# EAGLE design RFUSBtoDB15Adapter (EAGLE 9.6.2)
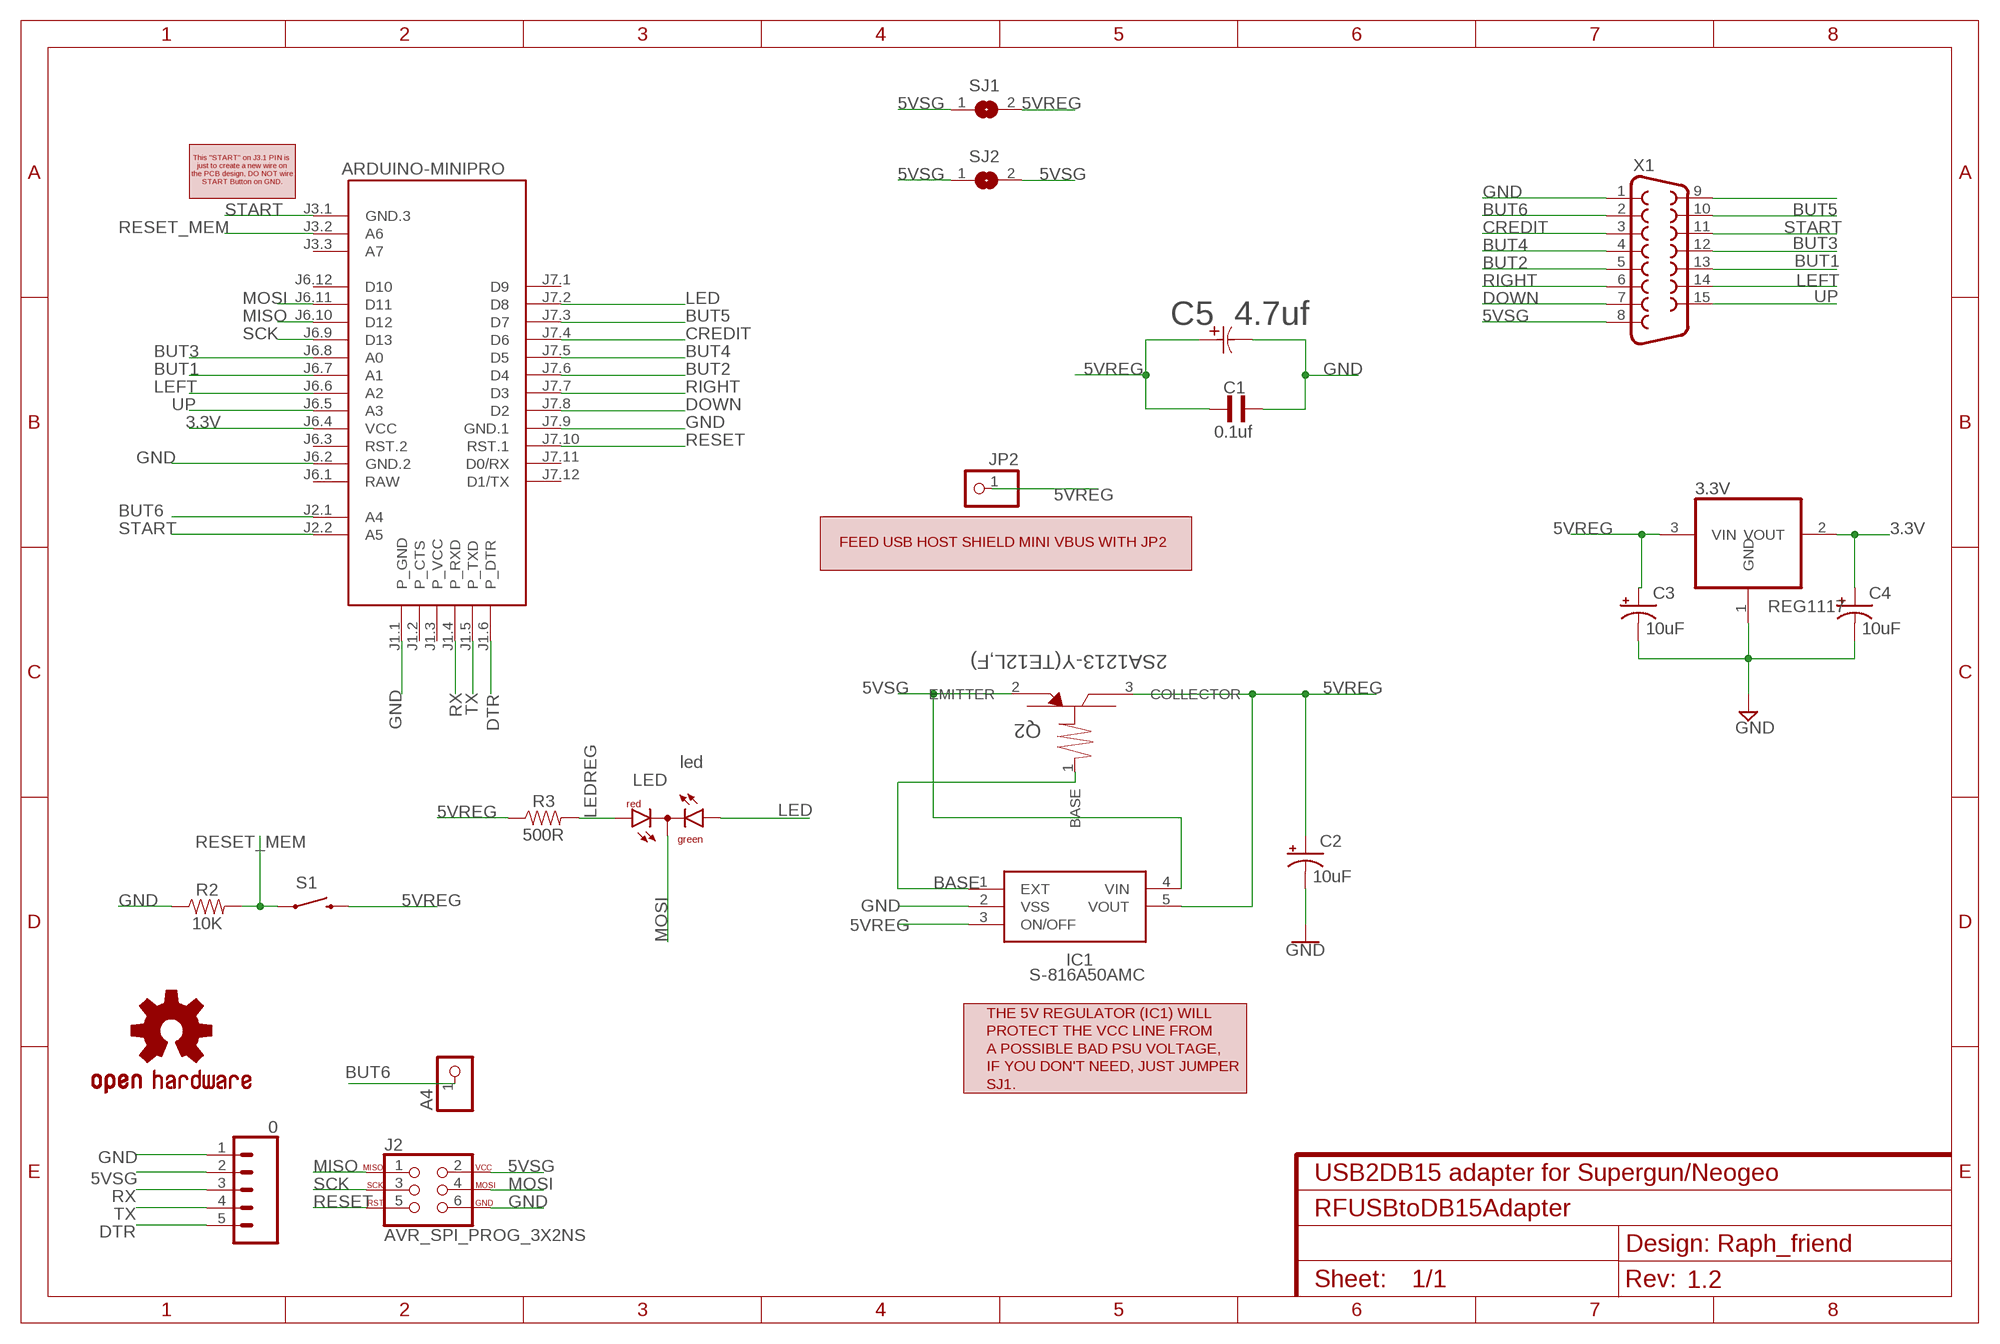
[diagram p0: schematic, sheet 1]
FRAME1 (FRAME-A4L): CNAME: USB2DB15 adapter for Supergun/Neogeo; CREVISION: 1.2; DESIGNER: Design: Raph_friend

## Parts
3.3V  REG1117  [SOT223]
A4  0  PINHD-1X1  [1X01]
ARDUINO-MINIPRO  ARDUINO-PRO-MINI-5.0V  [ARDUINO-PRO-MINI]
C1  0.1uf  WCAP-CSGP_0805_885012006082_REFLOW  [WCAP-CSGP_0805_REFLOW]
C2  10uF  10UF-POLAR-EIA3216-16V-10%(TANT)  [EIA3216]
C3  10uF  10UF-POLAR-EIA3216-16V-10%(TANT)  [EIA3216]
C4  10uF  10UF-POLAR-EIA3216-16V-10%(TANT)  [EIA3216]
C5  4.7uf  T491A475K010AT  [CAPMP3.4X1.6_1.8N_KEM]
IC1  S-816A40AMC-BAPT2U  [SOT95P275X130-5N]
J1  0  CONN_05  [1X05]
J2  AVR_SPI_PROG_3X2NS  [2X3-NS]
JP2  JP2  PINHD-1X1  [1X01]
LED  led  DUOLED-RG-C  [DUOLED-C-5MM]
LOGO1  OSHW-LOGOS  [OSHW-LOGO-S]
Q2  2SA1213-Y(TE12L,F)  [PW-MINI_TOS]
R2  10K  0.3OHM-0805-1/8W-1%  [0805]
R3  500R  0.3OHM-0805-1/8W-1%  [0805]
S1  RS032G05A3SM-SPST-MOMENTARY-SWSMD-1101NE  [TACTILE-SWITCH-1101NE]
SJ1  SJ  [SJ]
SJ2  SJ  [SJ]
X1  F15HP  [F15HP]

## Nets
3.3V: 3.3V.2(VOUT) ARDUINO-MINIPRO.J6.4(VCC) C4.+
5VREG: 3.3V.3(VIN) C1.2 C2.+ C3.+ C5.1 IC1.3(ON/OFF) IC1.5(VOUT) JP2.1 Q2.3(COLLECTOR) R3.1 S1.2 SJ1.2
5VSG: IC1.4(VIN) J1.2 J2.2 Q2.2(EMITTER) SJ1.1 SJ2.1 SJ2.2 X1.8
BASE: IC1.1(EXT) Q2.1(BASE)
BUT1: ARDUINO-MINIPRO.J6.7(A1) X1.13
BUT2: ARDUINO-MINIPRO.J7.6(D4) X1.5
BUT3: ARDUINO-MINIPRO.J6.8(A0) X1.12
BUT4: ARDUINO-MINIPRO.J7.5(D5) X1.4
BUT5: ARDUINO-MINIPRO.J7.3(D7) X1.10
BUT6: A4.1 ARDUINO-MINIPRO.J2.1(A4) X1.2
CREDIT: ARDUINO-MINIPRO.J7.4(D6) X1.3
DOWN: ARDUINO-MINIPRO.J7.8(D2) X1.7
DTR: ARDUINO-MINIPRO.J1.6(P_DTR) J1.5
GND: 3.3V.1(GND) ARDUINO-MINIPRO.J1.1(P_GND) ARDUINO-MINIPRO.J6.2(GND.2) ARDUINO-MINIPRO.J7.9(GND.1) C1.1 C2.- C3.- C4.- C5.2 IC1.2(VSS) J1.1 J2.6 R2.1 X1.1
LED: ARDUINO-MINIPRO.J7.2(D8) LED.AX(AG)
LEDREG: LED.AR R3.2
LEFT: ARDUINO-MINIPRO.J6.6(A2) X1.14
MISO: ARDUINO-MINIPRO.J6.10(D12) J2.1
MOSI: ARDUINO-MINIPRO.J6.11(D11) J2.4 LED.C
N$8: X1.9
RESET: ARDUINO-MINIPRO.J7.10(RST.1) J2.5
RESET_MEM: ARDUINO-MINIPRO.J3.2(A6) R2.2 S1.1
RIGHT: ARDUINO-MINIPRO.J7.7(D3) X1.6
RX: ARDUINO-MINIPRO.J1.4(P_RXD) J1.3
SCK: ARDUINO-MINIPRO.J6.9(D13) J2.3
START: ARDUINO-MINIPRO.J2.2(A5) ARDUINO-MINIPRO.J3.1(GND.3) X1.11
TX: ARDUINO-MINIPRO.J1.5(P_TXD) J1.4
UP: ARDUINO-MINIPRO.J6.5(A3) X1.15
Unconnected: ARDUINO-MINIPRO.J1.2(P_CTS) ARDUINO-MINIPRO.J1.3(P_VCC) ARDUINO-MINIPRO.J3.3(A7) ARDUINO-MINIPRO.J6.3(RST.2) ARDUINO-MINIPRO.J6.12(D10) ARDUINO-MINIPRO.J7.1(D9) ARDUINO-MINIPRO.J7.11(D0/RX) ARDUINO-MINIPRO.J7.12(D1/TX)

## Notes on the sheet
- This "START" on J3.1 PIN is 
  just to create a new wire on
   the PCB design, DO NOT wire 
  START Button on GND.
- FEED USB HOST SHIELD MINI VBUS WITH JP2
- THE 5V REGULATOR (IC1) WILL 
  PROTECT THE VCC LINE FROM 
  A POSSIBLE BAD PSU VOLTAGE, 
  IF YOU DON'T NEED, JUST JUMPER 
  SJ1.

## Power pins joined to a net without a drawn wire
RAW: ARDUINO-MINIPRO.J6.1(RAW)

## Library data of the parts
3.3V = burr-brown:REG1117: 800mA and 1A Low Dropout (LDO) Positive Regulator 1.8V, 2.5V, 2.85V, 3.3V, 5V, and Adj; MPN: REG1117; OC_FARNELL: 1097566; OC_NEWARK: 14P6981
A4 JP2 = pinhead:PINHD-1X1: PIN HEADER
ARDUINO-MINIPRO = Arduino:ARDUINO-PRO-MINI-*: Arduino Pro Mini and compatible devices More details available here: https://www.arduino.cc/en/Main/ArduinoBoardProMini Click here to find device on ebay.com <http://www.ebay.com/sch/arduino+pro+mini>
C1 = Wurth_Elektronik_Passive_Capacitors_rev18b:WCAP-CSGP_0805: WCAP-CSGP Ceramic Capacitors Characteristics Multilayer Ceramic Chip Capacitor Recommended soldering:Reflow, for 0603 and 0805 wave soldering is also allowed Operating temperature:-55 °C to +125 °C; Ceramic characteristics: Class I - NPO ; Class II -X7R, X5R High performance ceramic High capacitance stability Minimal aging Termination:Cu/Ni/Sn <http://katalog.we-online.de/media/images/eisos/WCAP-CSGP_pf2.jpg> Details see: http://katalog.we-online.de/en/pbs/WCAP-CSGP-0805? Created: 2015-01-28 2015 (C) Wurth Elektronik
C2-C4 = SparkFun-Capacitors:10UF-POLAR: 10.0µF polarized capacitors A capacitor is a passive two-terminal electrical component used to store electrical energy temporarily in an electric field.; PROD_ID: CAP-00811
C5 = tantalum cap:T491A475K010AT; BUILT_BY: EMA_Frank; MANUFACTURER_PART_NUMBER: T491A475K010AT; SOURCELIBRARY: Kemet_2020-03-25_3; SOURCE_LIBRARY: Kemet_2020-03-25_3.xlr; VENDOR: Kemet
IC1 = S-816A40AMC-BAPT2U:S-816A40AMC-BAPT2U: Linear Regulator Positive 4V 1A 5-Pin SOT-23 T/R - Tape and Reel Source: Datasheet; DESCRIPTION: Linear Regulator Positive 4V 1A 5-Pin SOT-23 T/R - Tape and Reel; HEIGHT: 1.3mm; MANUFACTURER_NAME: ABLIC U.S.A. Inc.; MANUFACTURER_PART_NUMBER: S-816A50AMC; MOUSER_PART_NUMBER: 628-816A40AMC-G; MOUSER_PRICE-STOCK: https://www.mouser.co.uk/ProductDetail/ABLIC/S-816A40AMC-BAPT2U?qs=sE1HjTVAc2jVIq95GYmZfQ%3D%3D
J1 = SparkFun-Connectors:CONN_05: Multi connection point. Often used as Generic Header-pin footprint for 0.1 inch spaced/style header connections On any of the 0.1 inch spaced packages, you can populate with these: Break Away Headers - Straight <https://www.sparkfun.com/products/116> (PRT-00116) Break Away Male Headers - Right Angle <https://www.sparkfun.com/products/553> (PRT-00553) Female Headers <https://www.sparkfun.com/products/115> (PRT-00115) Break Away Headers - Machine Pin <https://www.sparkfun.com/products/117> (PRT-00117) Break Away Female Headers - Swiss Machine Pin <https://www.sparkfun.com/products/743> (PRT-00743) For SCREWTERMINALS and SPRING TERMINALS visit here: Screw Terimnals on SparkFun.com <https://www.sparkfun.com/search/results?term=Screw+Terminals> (5mm/3.5mm/2.54mm spacing) This device is also useful as a general connection point to wire up your design to another part of your project. Our various solder wires solder well into these plated through hole pads. Hook-Up Wire - Assortment (Stranded, 22 AWG) <https://www.sparkfun.com/products/11375> (PRT-11375) Hook-Up Wire - Assortment (Solid Core, 22 AWG) <https://www.sparkfun.com/products/11367> (PRT-11367) View the entire wire category on our website here <https://www.sparkfun.com/categories/141> Special notes: Molex polarized connector foot print use with SKU : PRT-08231 with associated crimp pins and housings. 1MM SMD Version SKU: PRT-10208
J2 = SparkFun-Connectors:AVR_SPI_PROG_3X2: AVR ISP 6 Pin This is the reduced ISP connector for AVR programming. Common on Arduino. This footprint will take up less PCB space and can be used with a 10-pin to 6-pin adapter such as SKU: BOB-08508 **Special note about "TEST_POINT" package. The stop mask is on the top side, so if you want your programming test points to be on the bottom of your board, make sure to place this package on the bottom side of the board. This also ensure that the orientation to program from the bottom side will be correct. SparkFun Products: SparkFun ISP Pogo Adapter <https://www.sparkfun.com/products/11591> - NS Tiny AVR Programmer <https://www.sparkfun.com/products/11801> -PTH
LED = led:DUOLED-RG-C: DUO LED 2 colors (red/green), 5 mm, round, common Cathode www.ligitek.com or other producers.
LOGO1 = SparkFun-Aesthetics:OSHW-LOGO: Open-Source Hardware (OSHW) Logo This logo indicates the piece of hardware it is found on incorporates a OSHW license and/or adheres to the definition of open source hardware found here: http://freedomdefined.org/OSHW
Q2 = 2SA1213YTE12LF:2SA1213-Y(TE12L,F); BUILT_BY: EMA_UL_Team; COPYRIGHT: Copyright (C) 2018 Accelerated Designs. All rights reserved; MANUFACTURER_PART_NUMBER: 2SA1213-Y; SOURCELIBRARY: Toshiba_2019-12-10; VENDOR: Toshiba
R2 R3 = SparkFun-Resistors:0.3OHM: 0.3Ω resistor A resistor is a passive two-terminal electrical component that implements electrical resistance as a circuit element. Resistors act to reduce current flow, and, at the same time, act to lower voltage levels within circuits. - Wikipedia; PROD_ID: RES-11622; VALUE: 0.3
S1 = BeagleBone_Blue_R3:RS032G05A3SM-SPST-MOMENTARY-SW: 6x3.5mm 2-pin Momentary Switch (Push-button) Digikey Link <https://www.digikey.com/products/en?keywords=CKN10388TR-ND> Datasheet <https://media.digikey.com/pdf/Data%20Sheets/C&K/RS-032G05_-SM_RT.pdf>; PROD_ID: SWCH-00815
SJ1 SJ2 = jumper:SJ: SMD solder JUMPER
X1 = con-subd:F15: SUB-D; OC_FARNELL: unknown; OC_NEWARK: unknown

## Board
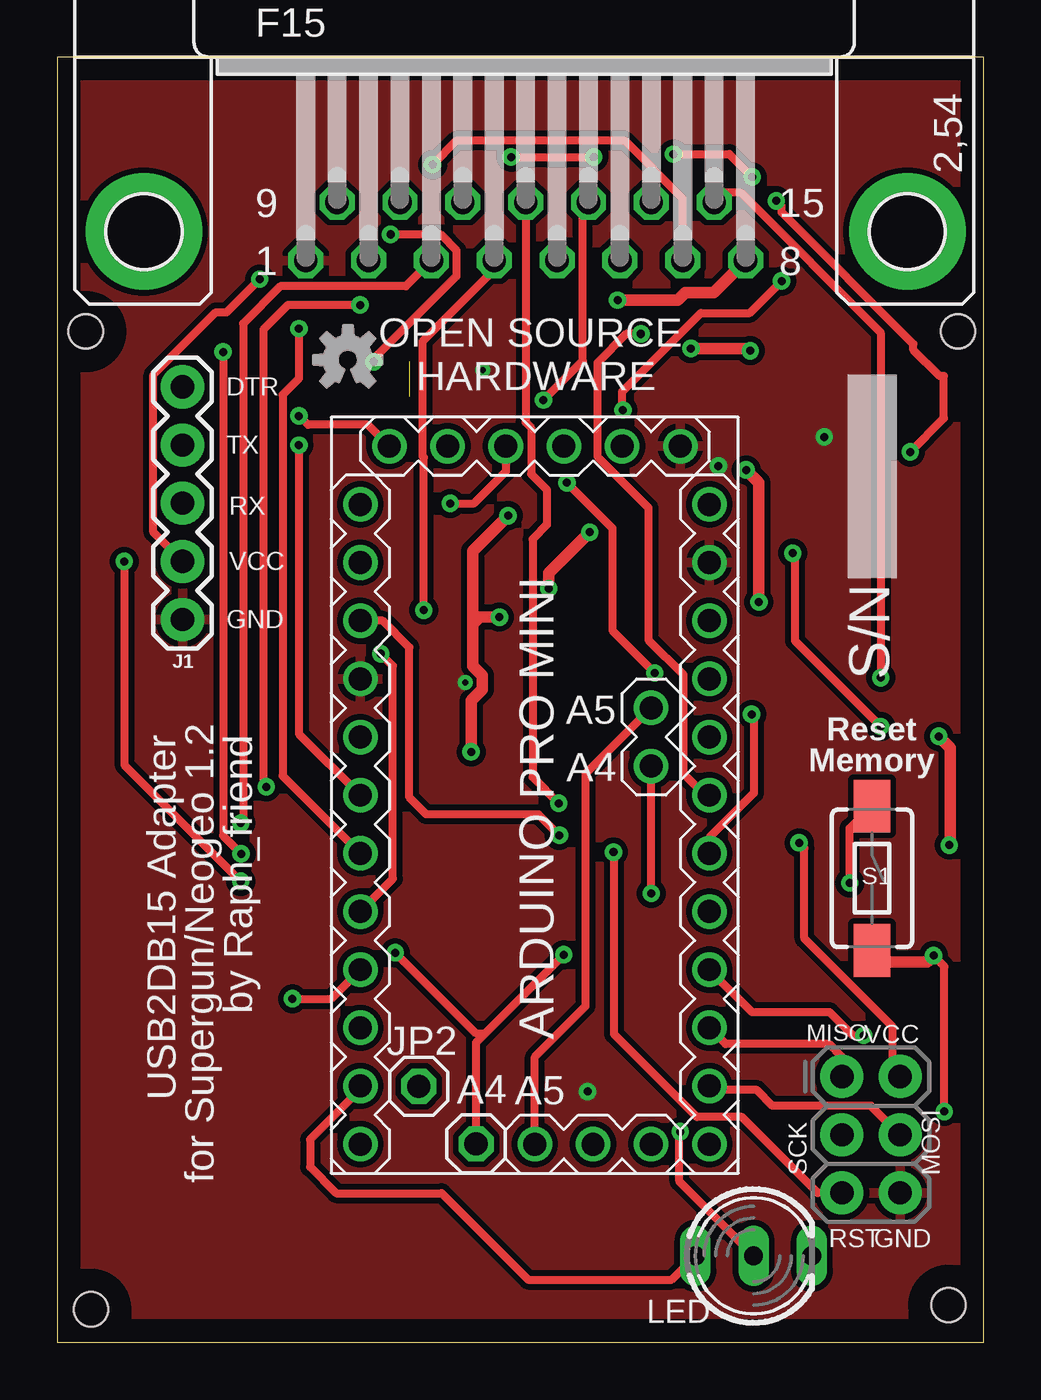
[diagram p1: board, top side]
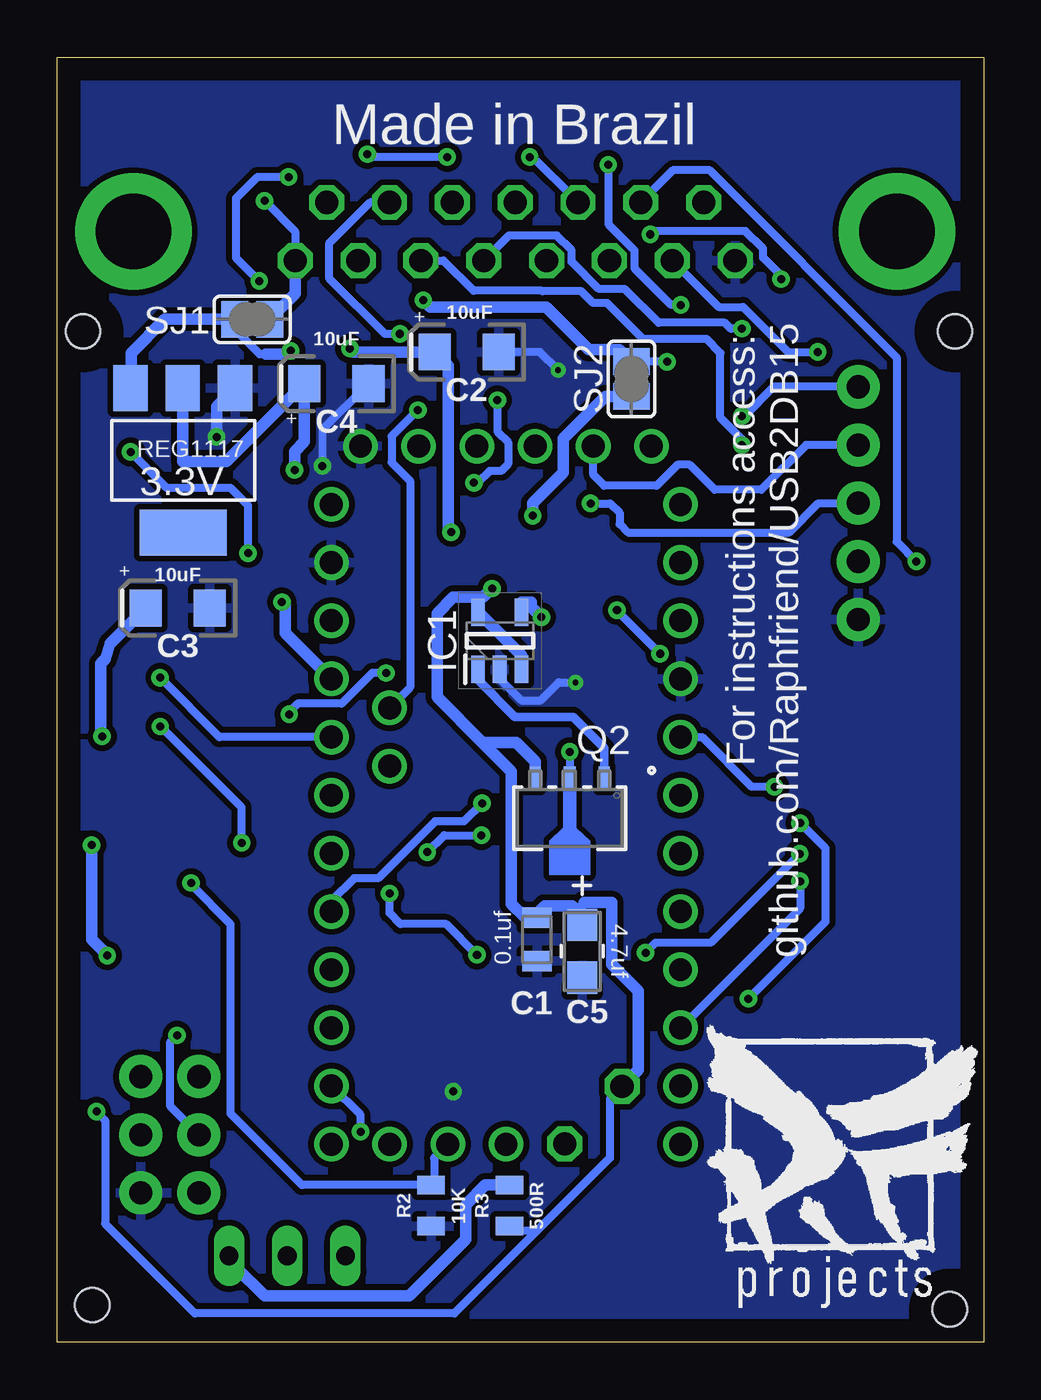
[diagram p2: board, bottom side, seen from below]

Size 40.44 x 56.12 mm. Coordinates in mm from the lower left corner, seen from the top.
Outline: 0,0 40.44,0 40.44,56.12 0,56.12 0,0
Copper layers (1*16): Top 0.035mm / dielectric 1.5mm / Bottom 0.035mm
Design rules "default *": minimum track width 14mil, minimum drill 0.25mm, track to track 10mil, track to pad 6mil, pad to pad 6mil, via to via 6mil, smd to smd 6mil, copper to edge 40mil, drill to drill 6mil, minimum pad ring 10mil, minimum via ring 8mil, stop-mask expansion 4mil, vias tented up to drill 50mil, thermal gap 10mil
Holes 1.5 mm at 1.24,44.14 39.32,44.14 38.91,1.62 1.47,1.44

### Footprints (pad centres in the part's own frame; a part is rotated, then mirrored left to right if it is on the bottom)
SOT223 = smd 1.499 x 2.007: 1 -2.261,-3.15; 2 0.025,-3.15; 3 2.311,-3.15 | smd 3.81 x 2.007: 4 0,3.15
1X01 = drill 1.016 octagon: 1 0,0
ARDUINO-PRO-MINI = drill 1: J1.1 -15.24,6.35; J1.2 -15.24,3.81; J1.3 -15.24,1.27; J1.4 -15.24,-1.27; J1.5 -15.24,-3.81; J1.6 -15.24,-6.35; J2.1 -1.27,5.08; J2.2 -3.81,5.08; J3.1 15.24,0; J3.2 15.24,2.54; J3.3 15.24,5.08; J6.1 -12.7,7.62; J6.2 -10.16,7.62; J6.3 -7.62,7.62; J6.4 -5.08,7.62; J6.5 -2.54,7.62; J6.6 0,7.62; J6.7 2.54,7.62; J6.8 5.08,7.62; J6.9 7.62,7.62; J6.10 10.16,7.62; J6.11 12.7,7.62; J6.12 15.24,7.62; J7.1 15.24,-7.62; J7.2 12.7,-7.62; J7.3 10.16,-7.62; J7.4 7.62,-7.62; J7.5 5.08,-7.62; J7.6 2.54,-7.62; J7.7 0,-7.62; J7.8 -2.54,-7.62; J7.9 -5.08,-7.62; J7.10 -7.62,-7.62; J7.11 -10.16,-7.62; J7.12 -12.7,-7.62
WCAP-CSGP_0805_REFLOW = smd 0.9 x 1.3: 1 -0.95,0; 2 0.95,0
EIA3216 = smd 1.4 x 1.6: + 1.4,0; - -1.4,0
CAPMP3.4X1.6_1.8N_KEM = smd 1.405 x 1.3: 1 -1.15,0; 2 1.15,0
SOT95P275X130-5N = smd 1.2 x 0.6: 1 -1.25,0.95; 2 -1.25,0; 3 -1.25,-0.95; 4 1.25,-0.95; 5 1.25,0.95
1X05 = drill 1.016 pad 1.88: 1 0,0; 2 2.54,0; 3 5.08,0; 4 7.62,0; 5 10.16,0
2X3-NS = drill 1.016 pad 1.88: 1 -2.54,-1.27; 2 -2.54,1.27; 3 0,-1.27; 4 0,1.27; 5 2.54,-1.27; 6 2.54,1.27
DUOLED-C-5MM = drill 0.813 long: AR 2.54,0; AX -2.54,0; C 0,0
PW-MINI_TOS = smd 0.483 x 1.016: 1 -1.5,-1.753; 3 1.5,-1.753 | smd 0.533 x 1.016: 2 0,-1.753
0805 = smd 0.8 x 1.2: 1 -0.9,0; 2 0.9,0
TACTILE-SWITCH-1101NE = smd 2.3 x 1.6: 1 -3.15,0; 2 3.15,0
SJ = smd 1.168 x 1.6: 1 -0.762,0; 2 0.762,0
F15HP = drill 1.016 octagon: 1 -9.601,-1.27; 2 -6.858,-1.27; 3 -4.115,-1.27; 4 -1.372,-1.27; 5 1.372,-1.27; 6 4.115,-1.27; 7 6.858,-1.27; 8 9.601,-1.27; 9 -8.23,1.27; 10 -5.486,1.27; 11 -2.743,1.27; 12 0,1.27; 13 2.743,1.27; 14 5.486,1.27; 15 8.23,1.27 | drill 3.302 pad 5.08: G1 -16.662,0; G2 16.662,0

### Placement (x,y rotation side)
3.3V  34.93,38.51 180 bottom
A4  18.28,8.66 0 top
ARDUINO-MINIPRO  20.85,23.89 270 top
C1  19.49,17.59 90 bottom
C2  22.57,43.25 180 bottom
C3  35.18,32.07 180 bottom
C4  28.25,41.86 180 bottom
C5  17.52,17.07 270 bottom
IC1  21.12,30.64 90 bottom
J1  5.47,31.56 90 top
J2  35.52,9.06 270 top
JP2  15.78,11.18 0 top
LED  30.4,3.78 0 top
LOGO1  12.68,42.9 0 top
Q2  18.07,22.89 180 bottom
R2  24.11,5.97 90 bottom
R3  20.7,5.97 90 bottom
S1  35.57,20.26 270 top
SJ1  31.93,44.67 180 bottom
SJ2  15.37,42.07 270 bottom
U$2  [RF_LOGO]  12.37,1.19 0 bottom
X1  20.45,48.51 0 top

### Tracks (layer width: path | path; a pad name or v marks a point on that pad's centre or on a via)
3.3V  (via drill 0.35)
  Top 0.508: v30.63,32.33 30.63,37.53 v30.07,38.09
  Bottom 0.508: 3.3V.2 34.77,41.47 34.95,41.29 34.95,38.45 33.07,38.45 C4.+ 29.65,39.33 30.08,38.9 v30.08,38.1 v30.07,38.09 | ARDUINO-MINIPRO.J6.4 30.48,30.98 30.48,32.17 v30.63,32.33
5VREG  (via drill 0.35)
  Top 0.356: S1.2 36.07,16.61 | v38.72,10.08 38.72,16.41 v38.25,16.88
  Top 0.508: v23.25,35.37 21.46,33.58 v21.46,32.92 | v38.25,16.88 37.98,16.61 36.07,16.61 | v27.66,43.4 30.15,43.4 v30.25,43.3 | v38.48,26.46 38.99,25.95 38.99,21.76 v38.94,21.71
  Bottom 0.356: v38.72,10.08 38.34,9.7 38.34,5.18 34.43,1.26 23.1,1.26 19.5,4.86 | JP2.1 16.32,10.64 16.32,8.05 19.5,4.86 | C5.1 17.52,19.12 17.43,19.22 | 19.5,4.86 20.5,4.86 R3.1 | 31.33,43.15 31.6,43.15 32.69,44.24
  Bottom 0.508: IC1.3 20.17,29.98 IC1.5 22.07,32.54 | 22.07,32.54 21.83,32.54 v21.46,32.92 | v23.25,35.37 23.38,35.5 23.38,42.66 C2.+ 27.51,43.25 v27.66,43.4 | 3.3V.3 37.22,41.69 37.22,43.19 35.74,44.67 SJ1.2 32.69,44.24 | Q2.3 19.57,25.35 20.41,26.19 21.88,26.19 | 21.88,26.19 23.86,28.17 23.86,31.83 23.15,32.54 22.07,32.54 | 21.88,26.19 20.61,24.92 20.61,19.15 20,18.54 C1.2 19.49,18.72 19.16,19.05 17.95,19.05 17.52,18.63 C5.1 | JP2.1 15.07,11.89 15.07,15.35 16.22,16.51 16.22,19.22 17.43,19.22 | 31.33,43.15 30.46,43.15 30.32,43.3 v30.25,43.3 | C3.+ 38.13,30.51 38.34,29.84 38.53,29.65 38.53,26.51 v38.48,26.46 | v38.25,16.88 38.25,16.91 38.94,17.59 v38.94,21.71
5VSG  (via drill 0.35)  (1 unrouted)
  Top 0.356: v13.82,42.82 13.82,42.95 17.42,46.56 17.42,47.69 16.73,48.38 v14.55,48.38 | J1.2 4.2,35.37 4.2,42.25 6.93,44.98 7.39,44.98 v8.84,46.42 | J2.2 36.47,11.92 36.47,13.77 32.61,17.63 32.61,21.58 v32.38,21.81 | v35.94,26.89 32.21,30.62 32.21,34.36 v32.11,34.46 | v37.24,38.88 38.71,40.35 38.71,42.19 38.51,42.19 37.38,43.33 37.38,43.59 31.62,49.34 31.62,49.62 31.4,49.84 v31.39,49.84
  Top 0.508: v18.07,25.78 18.07,28.03 18.55,28.51 18.55,29.12 18.13,29.53 18.13,31.36 | 18.13,31.36 18.44,31.67 v19.3,31.67 | X1.8 28.65,45.84 27.41,45.84 27.08,45.51 v24.46,45.51 | 18.13,31.36 18.13,34.55 v19.68,36.1
  Bottom 0.356: v18.07,25.78 Q2.2 | v8.84,46.42 8.84,46.58 9.63,47.36 9.63,47.77 10.39,48.53 14.55,48.53 v14.55,48.38 | v13.82,42.82 15.36,42.82 SJ2.1 | v32.38,21.81 32.38,23.36 35.92,26.89 v35.94,26.89 | v32.11,34.46 32.11,36.54 32.87,37.31 35.66,37.31 v37.24,38.88 | v31.39,49.84 30.05,48.51 30.05,47.03
  Bottom 0.508: IC1.4 20.17,32.32 19.74,32.32 19.74,32.1 v19.3,31.67 | SJ1.1 30.05,45.79 30.05,47.03 X1.8 | SJ2.1 15.9,43.35 17.24,43.35 19.09,45.2 24.16,45.2 v24.46,45.51 | SJ2.2 16.51,41.3 18.35,39.46 18.35,37.98 19.68,36.65 v19.68,36.1
BASE
  Bottom 0.381: Q2.1 16.57,25.96 17.92,27.31 20.46,27.31 22.07,28.92 IC1.1
BUT1  (via drill 0.35)
  Top 0.356: ARDUINO-MINIPRO.J6.7 28.47,22.04 30.41,23.98 30.41,27.32 v30.31,27.42 | X1.13 22.95,49.53 22.95,42.87 v21.23,41.14 | v22.25,37.53 24.23,35.55 24.23,31.08 v26.09,29.23
  Bottom 0.356: v22.25,37.53 22.07,37.53 21.56,38.05 21.06,38.05 20.76,38.35 20.76,39.3 21.23,39.77 v21.23,41.14 | v26.09,29.23 26.68,29.23 28.02,27.89 29.94,27.89 30.31,27.52 v30.31,27.42
BUT2  (via drill 0.35)
  Top 0.356: v10.55,44.26 10.55,42.09 9.84,41.38 9.84,24.74 ARDUINO-MINIPRO.J7.6
  Bottom 0.356: X1.5 20.73,48.33 18.62,48.33 17.98,47.69 17.98,47.19 16.79,46 15.67,46 14.19,44.52 11.29,44.52 11.03,44.26 v10.55,44.26
BUT3  (via drill 0.35)
  Top 0.356: X1.12 20.45,40.18 20.69,39.93 20.69,37.92 21.38,37.23 21.38,35.71 20.75,35.07 20.75,24.69 v21.9,23.54
  Bottom 0.356: v21.9,23.54 22.68,22.75 23.94,22.75 26.43,20.26 27.48,20.26 28.47,19.28 ARDUINO-MINIPRO.J6.8
BUT4  (via drill 0.35)
  Top 0.356: ARDUINO-MINIPRO.J7.5 14.66,20.24 14.66,29.53 v14.12,30.07 | v16,31.97 16,38.63 15.95,38.68 15.95,43.71 19.08,46.83 X1.4
  Bottom 0.356: v14.12,30.07 16,31.95 v16,31.97
BUT5  (via drill 0.35)
  Top 0.356: v2.93,34.1 2.93,25.21 v8.01,20.13
  Bottom 0.356: v8.01,20.13 8.01,18.95 ARDUINO-MINIPRO.J7.3 | X1.10 13.54,51.2 11.98,51.2 3.79,43.01 3.79,34.97 v2.93,34.1
BUT6  (via drill 0.35)
  Top 0.356: v25.93,19.6 ARDUINO-MINIPRO.J2.1 | 18.68,13.49 18.28,13.09 A4.1 | 18.68,13.49 v22.11,16.92 | v7.24,43.25 7.24,22.12 v8.03,21.33 | v14.76,17.01 18.28,13.49 18.68,13.49
  Bottom 0.356: v22.11,16.92 23.46,18.26 25.45,18.26 25.93,18.74 v25.93,19.6 | X1.2 11.56,45.21 10.49,45.21 8.53,43.25 v7.24,43.25 | v8.03,21.33 11.91,17.44 14.33,17.44 v14.76,17.01
CREDIT  (via drill 0.35)
  Top 0.356: X1.3 15.21,46.12 9.74,46.12 8.11,44.49 8.11,22.77 v8.01,22.67 | ARDUINO-MINIPRO.J7.4 11.96,15 v10.27,15
  Bottom 0.356: v10.27,15 6.91,18.36 6.91,21.58 v8.01,22.67
DOWN  (via drill 0.35)
  Top 0.356: X1.7 27.3,49.95 24.79,52.47 17.42,52.47 v16.38,51.43 | v13.22,45.3 10.07,45.3 9,44.23 9,24.68 9,24.69 9,24.38 v9.12,24.26
  Bottom 0.356: ARDUINO-MINIPRO.J7.8 12.29,26.43 10.11,24.26 v9.12,24.26 | v16.38,51.43 16.38,48.83 15.24,47.69 15.24,46.9 13.63,45.3 v13.22,45.3
DTR  (via drill 0.35)
  Top 0.356: ARDUINO-MINIPRO.J1.6 13.56,40.06 10.94,40.06 v10.55,40.45
  Bottom 0.356: J1.5 9.16,41.72 10.43,40.45 v10.55,40.45
GND  (via drill 0.25, 0.35)
  Bottom 0.356: IC1.2 21.12,28.97 20.18,28.03 19.34,28.03 18.55,28.82 v17.81,28.82 | v28.86,38.27 28.86,39.85 C4.- | v18.58,42.45 19.37,43.25 C2.-
  Bottom 0.508: 3.3V.1 33.48,40.85 v33.48,39.54
  other vias: 23.15,10.95
  pour Top: -7.75,60.32 49.4,60.32 49.4,-15.88 -7.75,-15.88
  pour Bottom: -6.48,59.05 48.13,59.05 48.13,-13.34 -6.48,-13.34
LED
  Top 0.356: ARDUINO-MINIPRO.J7.2 13.23,11.05 11.03,8.86 11.03,7.66 12.18,6.51 16.78,6.51 20.56,2.74 26.82,2.74 LED.AX
LEDREG
  Bottom 0.508: LED.AR 32.66,3.5 32.66,3.29 31.39,2.02 25.07,2.02 22.61,4.49 22.61,6.01 21.75,6.87 R3.2
LEFT  (via drill 0.35)
  Top 0.356: v25.48,44.04 24.84,44.04 23.57,42.77 23.57,38.68 25.81,36.45 25.81,30.68 27.33,29.15 27.33,24.83 28.27,23.89 ARDUINO-MINIPRO.J6.6
  Bottom 0.356: X1.14 26.77,49.78 28.58,47.97 28.58,46.47 26.14,44.04 v25.48,44.04
MISO
  Top 0.356: J2.1 34.25,12.47 33.7,13.02 29.18,13.02 ARDUINO-MINIPRO.J6.10
MOSI  (via drill 0.35)
  Top 0.356: J2.4 35.52,10.33 31.22,10.33 30.54,11.02 28.64,11.02 ARDUINO-MINIPRO.J6.11 | LED.C 27.15,7.02 27.15,9.15 v27.2,9.2
  Bottom 0.356: v27.2,9.2 27.2,9.92 ARDUINO-MINIPRO.J6.11
RESET  (via drill 0.35)
  Top 0.356: J2.5 33.2,6.52 29.88,9.84 27.93,9.84 24.31,13.45 24.31,21.38 v24.28,21.4 | v21.92,22.14 21.01,23.06 16.1,23.06 15.37,23.79 15.37,30.35 14.2,31.51 ARDUINO-MINIPRO.J7.10
  Bottom 0.356: v24.28,21.4 23.55,22.14 v21.92,22.14
RESET_MEM  (via drill 0.35)
  Top 0.356: v34.59,20.06 34.59,22.44 S1.1
  Bottom 0.356: ARDUINO-MINIPRO.J3.2 23.99,8.05 23.99,6.99 R2.2 29.76,6.87 32.87,9.97 32.87,18.26 34.59,19.98 v34.59,20.06
RIGHT  (via drill 0.35)
  Top 0.356: v10.55,39.18 10.55,26.57 ARDUINO-MINIPRO.J7.7
  Bottom 0.356: X1.6 23.58,47.24 22.26,45.92 19.28,45.92 19.26,45.9 17.55,45.9 17.05,45.39 16.43,45.39 14.86,43.81 12.09,43.81 11.48,43.21 11.48,40.39 10.55,39.45 v10.55,39.18
RX  (via drill 0.35)
  Top 0.356: v17.16,36.63 18.18,36.63 19.58,38.03 ARDUINO-MINIPRO.J1.4
  Bottom 0.356: v17.16,36.63 16.3,36.63 15.89,36.22 15.89,35.72 15.53,35.36 8.49,35.36 7.21,36.64 J1.3
SCK  (via drill 0.35)
  Top 0.356: ARDUINO-MINIPRO.J6.9 30.32,14.42 33.71,14.42 34.72,13.4 v35.2,13.4
  Bottom 0.356: v35.2,13.4 35.52,13.08 35.52,10.33 J2.3
START  (via drill 0.35)
  Top 0.356: ARDUINO-MINIPRO.J3.1 20.85,12.46 23.07,14.68 23.07,24.84 ARDUINO-MINIPRO.J2.2 | v26.9,51.88 29.34,51.88 v30.34,50.88 | v24.7,40.71 24.65,40.76 24.65,41.5 28.09,44.95 30.23,44.95 v31.62,46.35 | v19.81,51.76 v23.42,51.76
  Bottom 0.356: v24.7,40.71 25.84,39.56 25.84,38.42 25.03,37.61 25.03,28.6 ARDUINO-MINIPRO.J2.2 | X1.11 19.81,51.88 v19.81,51.76 | v30.34,50.88 31.7,50.88 32.64,49.95 32.64,47.36 v31.62,46.35 | v23.42,51.76 26.77,51.76 v26.9,51.88
TX
  Bottom 0.356: J1.4 7.75,39.18 9.7,37.23 11.73,37.23 12.83,38.32 13.36,38.32 14.28,37.41 16.56,37.41 17.04,37.88 ARDUINO-MINIPRO.J1.5
UP  (via drill 0.35)
  Top 0.356: X1.15 29.1,50.2 29.85,50.2 35.95,44.1 v35.95,29.02
  Bottom 0.356: v35.95,29.02 33.35,26.43 ARDUINO-MINIPRO.J6.5

### Text on the board
tNames: DTR | OPEN SOURCE / HARDWARE | TX | RX | VCC | GND | A5 | S/N | USB2DB15 Adapter / for Supergun/Neogeo 1.2 / by Raph_friend | Reset / Memory | A4 | ARDUINO PRO MINI | MISO | VCC | A5 | SCK | MOSI | RST | GND
bNames: Made in Brazil | For instructions access: / github.com/Raphfriend/USB2DB15 | + | + | +